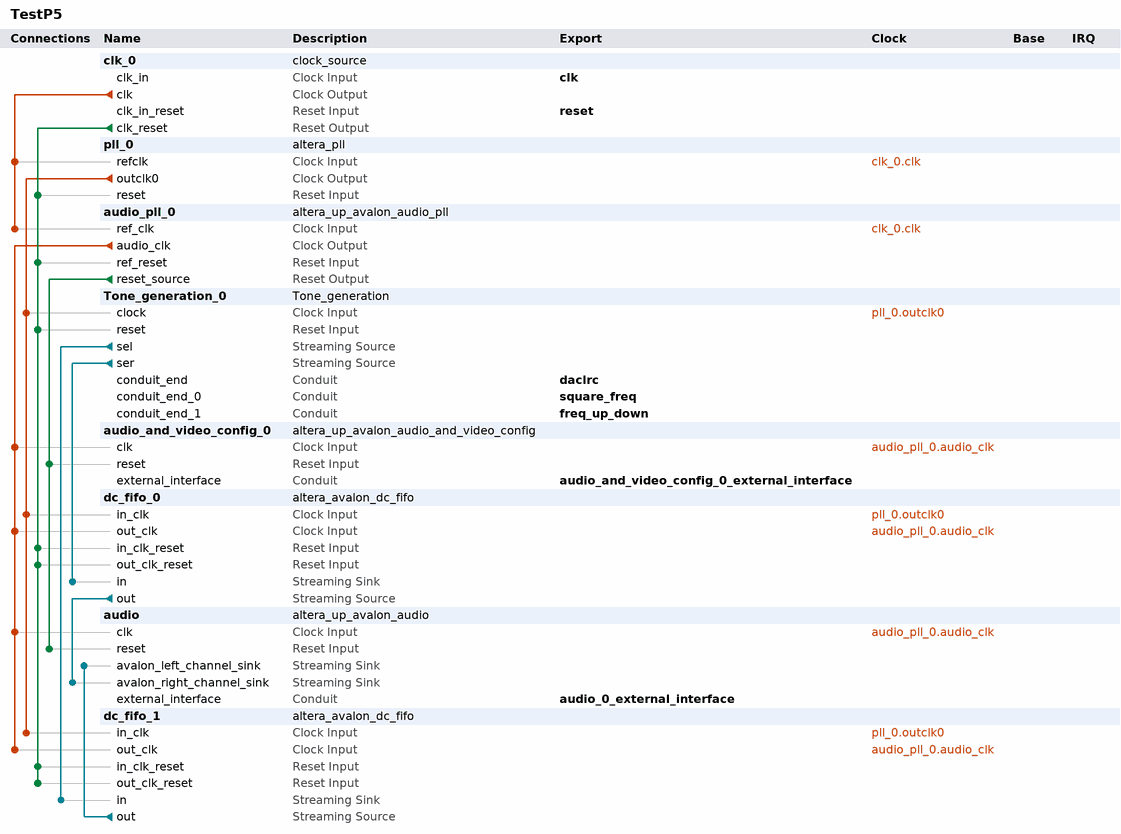
[diagram p0: system contents]
# Platform Designer (Qsys) system TestP5, Cyclone V 5CSEMA5F31C6
# Parameters at their usual value, and those the tool derives, are not listed.
package require -exact qsys 17.1
create_system TestP5
set_project_property DEVICE_FAMILY {Cyclone V}
set_project_property DEVICE 5CSEMA5F31C6

add_instance clk_0 clock_source 17.1
set_instance_parameter_value clk_0 clockFrequency 50000000

add_instance pll_0 altera_pll 17.1
set_instance_parameter_value pll_0 gui_device_speed_grade 1
set_instance_parameter_value pll_0 gui_number_of_clocks 1
set_instance_parameter_value pll_0 gui_operation_mode direct
set_instance_parameter_value pll_0 gui_output_clock_frequency0 48.0
set_instance_parameter_value pll_0 gui_pll_mode {Integer-N PLL}
set_instance_parameter_value pll_0 gui_reference_clock_frequency 50.0
set_instance_parameter_value pll_0 gui_use_locked false

add_instance audio_pll_0 altera_up_avalon_audio_pll 17.1
set_instance_parameter_value audio_pll_0 gui_refclk 50.0

add_instance Tone_generation_0 Tone_generation 1.1
set_instance_parameter_value Tone_generation_0 dat_len_avl 31

add_instance audio_and_video_config_0 altera_up_avalon_audio_and_video_config 17.1
set_instance_parameter_value audio_and_video_config_0 audio_in {Microphone to ADC}
set_instance_parameter_value audio_and_video_config_0 bit_length 24
set_instance_parameter_value audio_and_video_config_0 board DE1-SoC
set_instance_parameter_value audio_and_video_config_0 line_in_bypass false
set_instance_parameter_value audio_and_video_config_0 sampling_rate {48 kHz}

add_instance dc_fifo_0 altera_avalon_dc_fifo 17.1
set_instance_parameter_value dc_fifo_0 BITS_PER_SYMBOL 24
set_instance_parameter_value dc_fifo_0 EXPLICIT_MAXCHANNEL 1
set_instance_parameter_value dc_fifo_0 FIFO_DEPTH 32
set_instance_parameter_value dc_fifo_0 USE_PACKETS 0

add_instance audio altera_up_avalon_audio 17.1
set_instance_parameter_value audio audio_in false
set_instance_parameter_value audio avalon_bus_type Streaming
set_instance_parameter_value audio dw 24

add_instance dc_fifo_1 altera_avalon_dc_fifo 17.1
set_instance_parameter_value dc_fifo_1 BITS_PER_SYMBOL 24
set_instance_parameter_value dc_fifo_1 EXPLICIT_MAXCHANNEL 1
set_instance_parameter_value dc_fifo_1 FIFO_DEPTH 32
set_instance_parameter_value dc_fifo_1 USE_PACKETS 0

# connections
add_connection audio_pll_0.audio_clk audio.clk clock
add_connection audio_pll_0.audio_clk audio_and_video_config_0.clk clock
add_connection audio_pll_0.audio_clk dc_fifo_0.out_clk clock
add_connection audio_pll_0.audio_clk dc_fifo_1.out_clk clock
add_connection clk_0.clk audio_pll_0.ref_clk clock
add_connection clk_0.clk pll_0.refclk clock
add_connection pll_0.outclk0 dc_fifo_0.in_clk clock
add_connection pll_0.outclk0 dc_fifo_1.in_clk clock
add_connection pll_0.outclk0 Tone_generation_0.clock clock
add_connection audio_pll_0.reset_source audio.reset reset
add_connection audio_pll_0.reset_source audio_and_video_config_0.reset reset
add_connection clk_0.clk_reset audio_pll_0.ref_reset reset
add_connection clk_0.clk_reset dc_fifo_0.in_clk_reset reset
add_connection clk_0.clk_reset dc_fifo_0.out_clk_reset reset
add_connection clk_0.clk_reset dc_fifo_1.in_clk_reset reset
add_connection clk_0.clk_reset dc_fifo_1.out_clk_reset reset
add_connection clk_0.clk_reset pll_0.reset reset
add_connection clk_0.clk_reset Tone_generation_0.reset reset
add_connection dc_fifo_0.out audio.avalon_right_channel_sink avalon_streaming
add_connection dc_fifo_1.out audio.avalon_left_channel_sink avalon_streaming
add_connection Tone_generation_0.sel dc_fifo_1.in avalon_streaming
add_connection Tone_generation_0.ser dc_fifo_0.in avalon_streaming

# exported interfaces
add_interface audio_0_external_interface conduit end
set_interface_property audio_0_external_interface EXPORT_OF audio.external_interface
add_interface audio_and_video_config_0_external_interface conduit end
set_interface_property audio_and_video_config_0_external_interface EXPORT_OF audio_and_video_config_0.external_interface
add_interface clk clock sink
set_interface_property clk EXPORT_OF clk_0.clk_in
add_interface daclrc conduit end
set_interface_property daclrc EXPORT_OF Tone_generation_0.conduit_end
add_interface freq_up_down conduit end
set_interface_property freq_up_down EXPORT_OF Tone_generation_0.conduit_end_1
add_interface reset reset sink
set_interface_property reset EXPORT_OF clk_0.clk_in_reset
add_interface square_freq conduit end
set_interface_property square_freq EXPORT_OF Tone_generation_0.conduit_end_0

set_interconnect_requirement {$system} qsys_mm.clockCrossingAdapter HANDSHAKE
set_interconnect_requirement {$system} qsys_mm.enableEccProtection FALSE
set_interconnect_requirement {$system} qsys_mm.insertDefaultSlave FALSE
set_interconnect_requirement {$system} qsys_mm.maxAdditionalLatency 1

save_system TestP5.qsys
